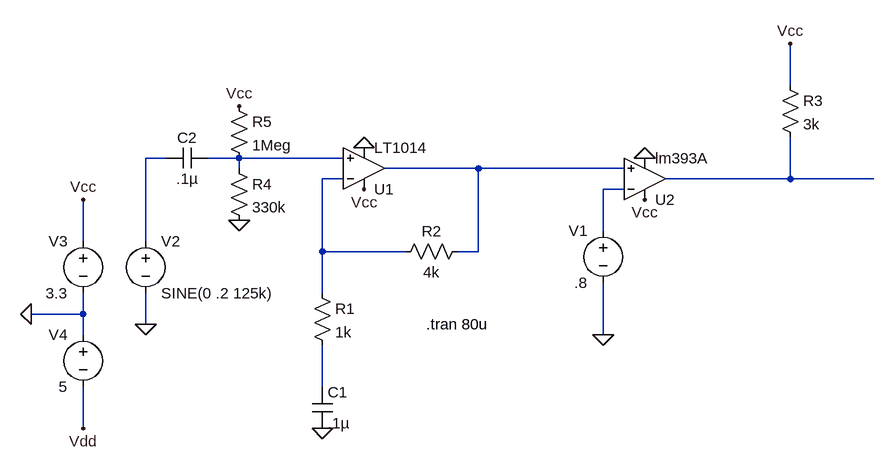
[diagram p0: schematic amp_comparator.asc]
amp_comparator.asc, the LTspice schematic file:
Version 4
SHEET 1 1668 1036
WIRE 1120 272 1120 208
WIRE 160 384 128 384
WIRE 272 384 224 384
WIRE 432 384 272 384
WIRE 272 400 272 384
WIRE 640 400 496 400
WIRE 864 400 640 400
WIRE 432 416 400 416
WIRE 1120 416 1120 352
WIRE 1120 416 928 416
WIRE 1248 416 1120 416
WIRE 864 432 832 432
WIRE 832 496 832 432
WIRE 32 512 32 448
WIRE 128 512 128 384
WIRE 400 528 400 416
WIRE 528 528 400 528
WIRE 640 528 640 400
WIRE 640 528 608 528
WIRE 400 592 400 528
WIRE 32 624 32 592
WIRE 32 624 -48 624
WIRE 128 640 128 592
WIRE 32 656 32 624
WIRE 832 656 832 576
WIRE 400 736 400 672
WIRE 32 800 32 736
FLAG 128 640 0
FLAG -48 624 0
FLAG 32 448 Vcc
FLAG 832 656 0
FLAG 32 800 Vdd
FLAG 464 432 Vcc
FLAG 400 800 0
FLAG 1120 208 Vcc
FLAG 896 448 Vcc
FLAG 272 480 0
FLAG 896 384 0
FLAG 272 304 Vcc
FLAG 464 368 0
SYMBOL voltage 128 496 R0
SYMATTR InstName V2
SYMATTR Value SINE(0 .2 125k)
SYMBOL voltage 32 496 M0
SYMATTR InstName V3
SYMATTR Value 3.3
SYMBOL voltage 832 480 M0
SYMATTR InstName V1
SYMATTR Value .8
SYMBOL voltage 32 640 M0
SYMATTR InstName V4
SYMATTR Value 5
SYMBOL res 384 576 R0
SYMATTR InstName R1
SYMATTR Value 1k
SYMBOL res 624 512 R90
WINDOW 0 0 56 VBottom 2
WINDOW 3 32 56 VTop 2
SYMATTR InstName R2
SYMATTR Value 4k
SYMBOL Comparators/lm393A 896 416 M180
SYMATTR InstName U2
SYMBOL res 1104 256 R0
SYMATTR InstName R3
SYMATTR Value 3k
SYMBOL res 256 384 R0
SYMATTR InstName R4
SYMATTR Value 330k
SYMBOL cap 384 736 R0
SYMATTR InstName C1
SYMATTR Value .1µ
SYMBOL cap 224 368 R90
WINDOW 0 0 32 VBottom 2
WINDOW 3 32 32 VTop 2
SYMATTR InstName C2
SYMATTR Value .1µ
SYMBOL res 256 288 R0
SYMATTR InstName R5
SYMATTR Value 1Meg
SYMBOL OpAmps/LT1014 464 464 M180
SYMATTR InstName U1
TEXT 560 640 Left 2 !.tran 80u

The netlist it stands for:
* amp_comparator.asc
V2 N001 0 SINE(0 .2 125k)
V3 Vcc 0 3.3
V1 N006 0 .8
V4 0 Vdd 5
R1 N004 N007 1k
R2 N003 N004 4k
* U2: lm393A (symbol Comparators/lm393A not available, pins judged from their places): In+=N003 In-=N006 V+=Vcc V-=0 OUT=N005
R3 Vcc N005 3k
R4 N002 0 330k
C1 N007 0 .1µ
C2 N002 N001 .1µ
R5 Vcc N002 1Meg
XU1 N002 N004 Vcc 0 N003 LT1014  ; pins In+ In- V+ V- OUT
.tran 80u
.backanno
.end